# Altium schematic sheet FPGA.SchDoc
size 840 x 594 mm; SheetNumber: 2; SheetTotal: 4
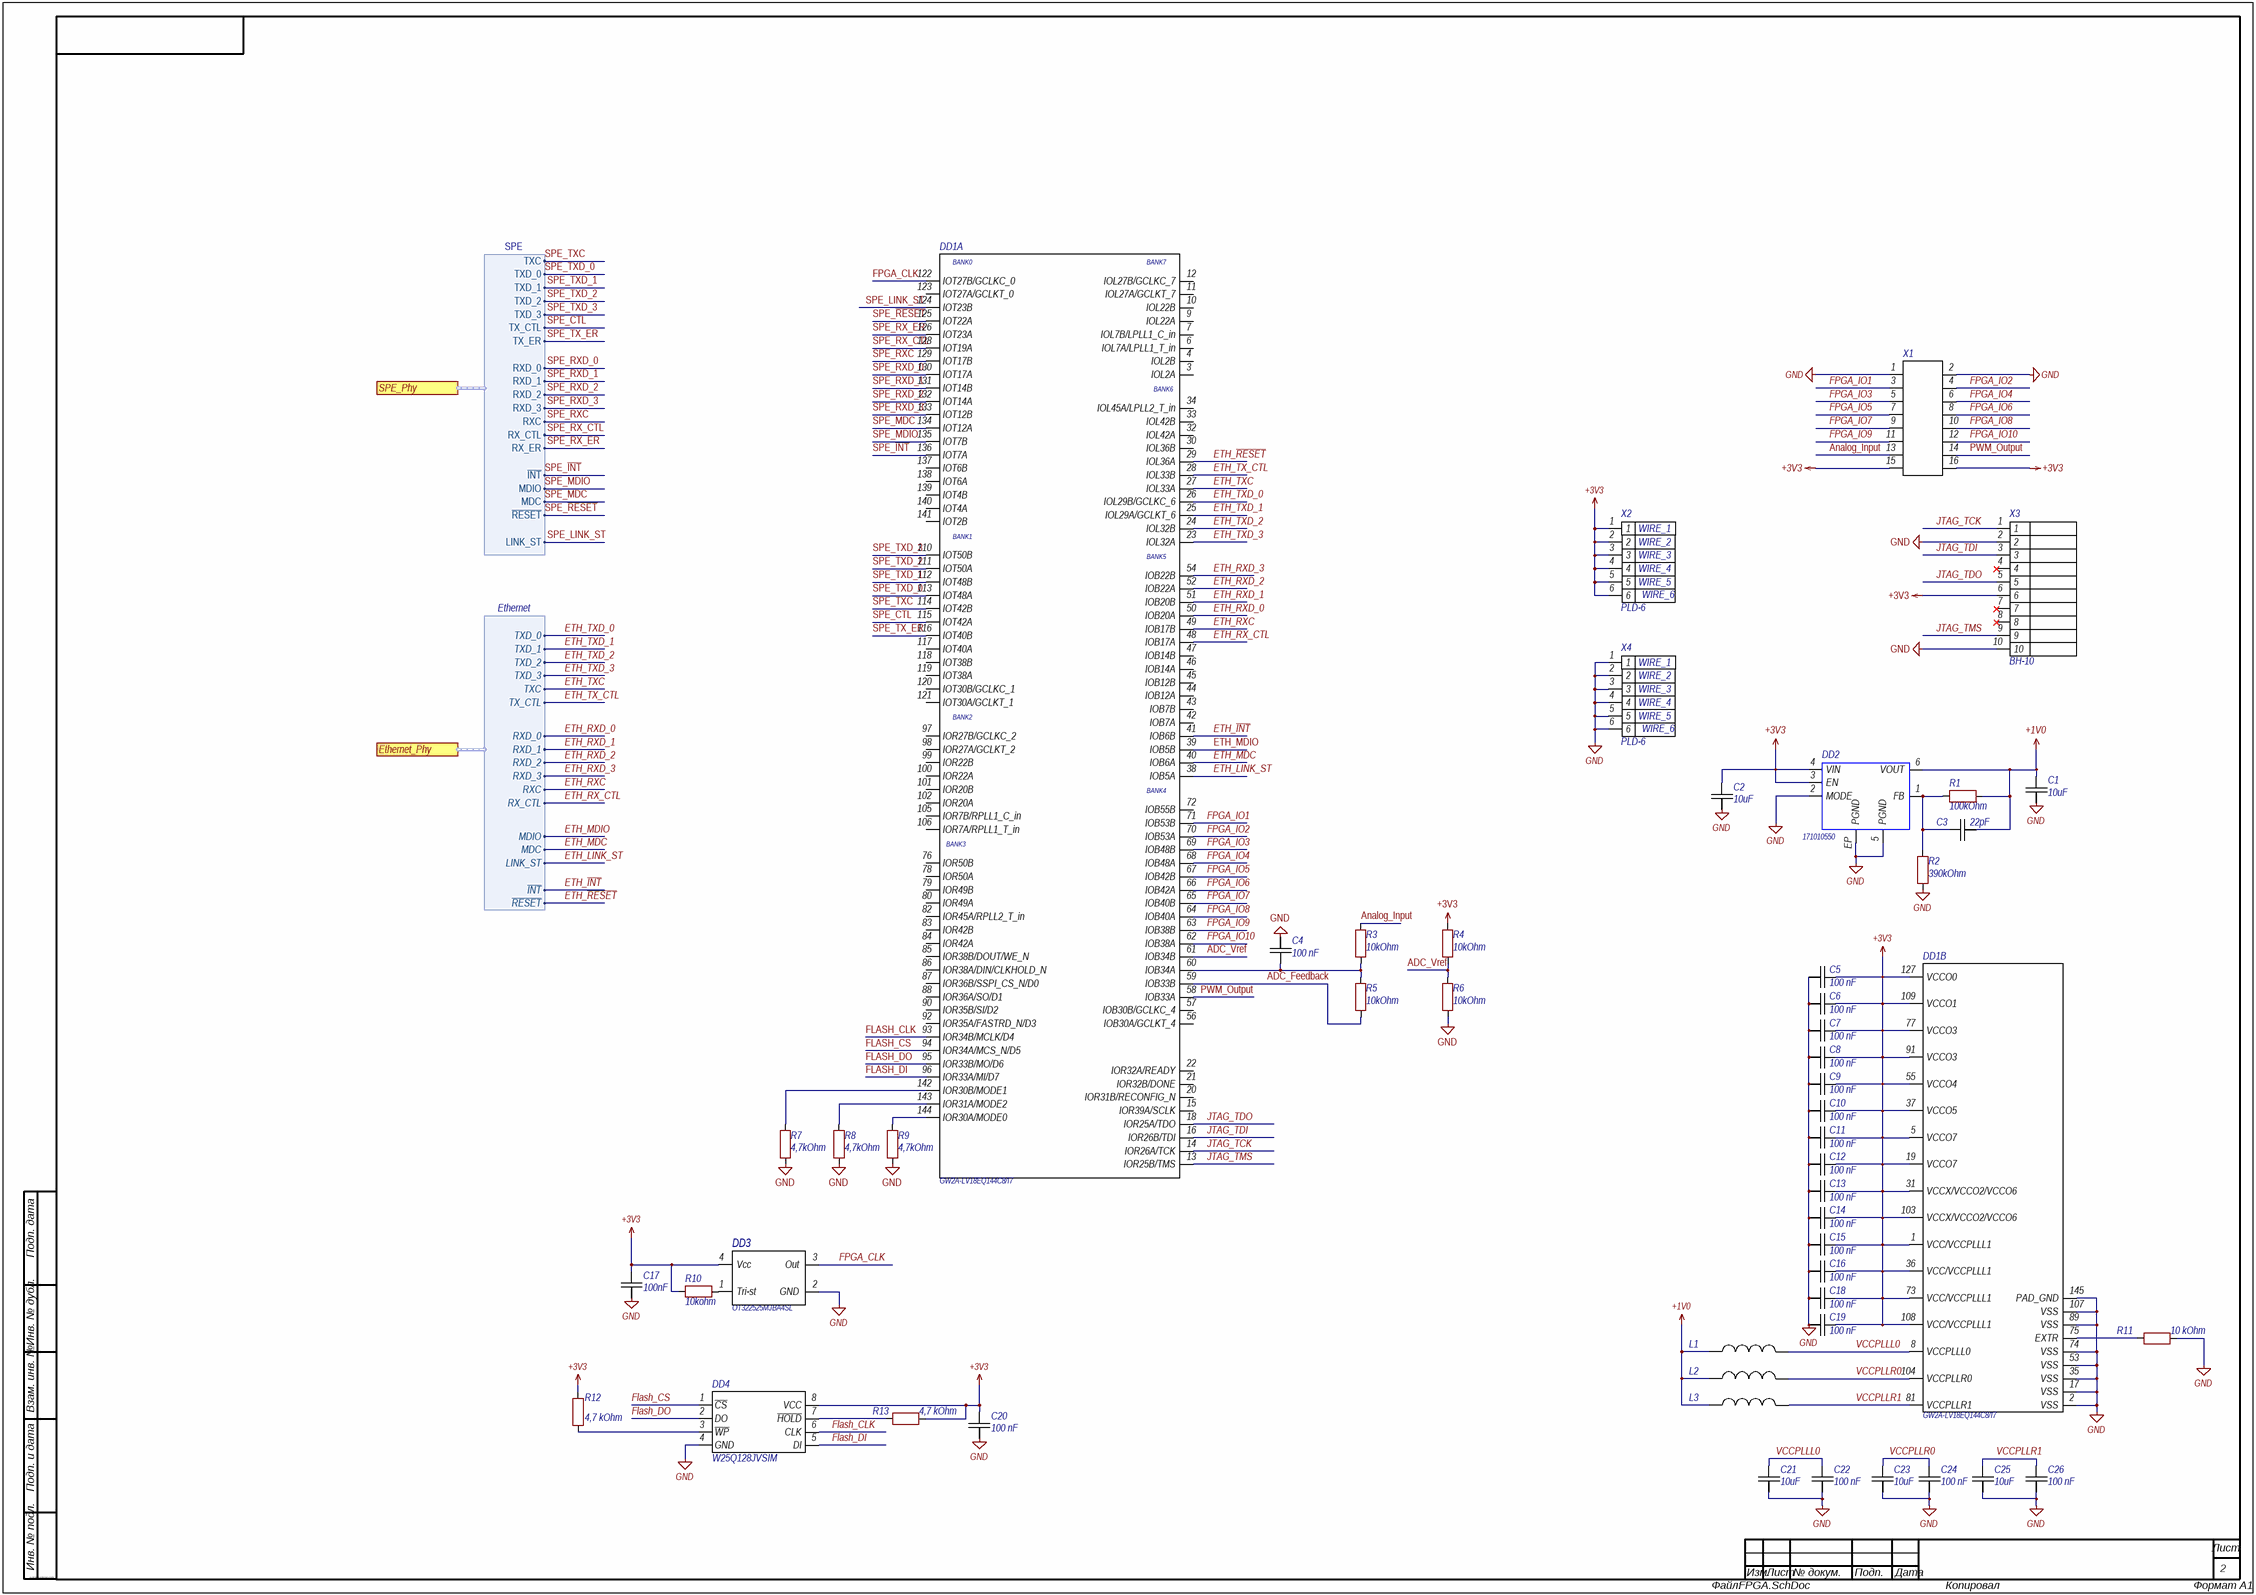
[diagram p0: FPGA.SchDoc]

## Parts
C1  value 10uF  [CAPC0603N]  (hidden comment: 10uF 25V)
C2  value 10uF  [CAPC0603N]  (hidden comment: 10uF 25V)
C3  value 22pF  [CAP0402]  (hidden comment: 22pF 50V)
C4  value 100 nF  [CAP0402]  (hidden comment: 100 nF *)
C5  value 100 nF  [CAP0402]  (hidden comment: 100 nF 50V)
C6  value 100 nF  [CAP0402]  (hidden comment: 100 nF 50V)
C7  value 100 nF  [CAP0402]  (hidden comment: 100 nF 50V)
C8  value 100 nF  [CAP0402]  (hidden comment: 100 nF 50V)
C9  value 100 nF  [CAP0402]  (hidden comment: 100 nF 50V)
C10  value 100 nF  [CAP0402]  (hidden comment: 100 nF 50V)
C11  value 100 nF  [CAP0402]  (hidden comment: 100 nF 50V)
C12  value 100 nF  [CAP0402]  (hidden comment: 100 nF 50V)
C13  value 100 nF  [CAP0402]  (hidden comment: 100 nF 50V)
C14  value 100 nF  [CAP0402]  (hidden comment: 100 nF 50V)
C15  value 100 nF  [CAP0402]  (hidden comment: 100 nF 50V)
C16  value 100 nF  [CAP0402]  (hidden comment: 100 nF 50V)
C17  value 100nF  [CAP0402]  (hidden comment: 100nF 50V)
C18  value 100 nF  [CAP0402]  (hidden comment: 100 nF 50V)
C19  value 100 nF  [CAP0402]  (hidden comment: 100 nF 50V)
C20  value 100 nF  [CAP0402]  (hidden comment: 100 nF 50V)
C21  value 10uF  [CAPC0603N]  (hidden comment: 10uF 25V)
C22  value 100 nF  [CAP0402]  (hidden comment: 100 nF 50V)
C23  value 10uF  [CAPC0603N]  (hidden comment: 10uF 25V)
C24  value 100 nF  [CAP0402]  (hidden comment: 100 nF 50V)
C25  value 10uF  [CAPC0603N]  (hidden comment: 10uF 25V)
C26  value 100 nF  [CAP0402]  (hidden comment: 100 nF 50V)
DD1  MPN: GW2A-LV18EQ144C8/I7  [EQ144]  (parts A,B of 2)
DD2  (no value)  [171010550]
DD3  MPN: OT322525MJBA4SL  [TSX-3225_V]  (hidden comment: 25MHz)
DD4  MPN: W25Q128JVSIM  [SO-8]
L1  (no value)  [CAPC0603N]
L2  (no value)  [CAPC0603N]
L3  (no value)  [CAPC0603N]
R1  100kOhm  [RESC0402(1005)_M]
R2  390kOhm  [RESC0402(1005)_M]
R3  10kOhm  [RESC0402(1005)_M]
R4  10kOhm  [RESC0402(1005)_M]
R5  10kOhm  [RESC0402(1005)_M]
R6  10kOhm  [RESC0402(1005)_M]
R7  4,7kOhm  [RESC0402(1005)_M]
R8  4,7kOhm  [RESC0402(1005)_M]
R9  4,7kOhm  [RESC0402(1005)_M]
R10  10kohm  [RESC0402(1005)_M]
R11  10 kOhm  [RESC0402(1005)_M]
R12  4,7 kOhm  [RESC0402(1005)_M]
R13  4,7 kOhm  [RESC0402(1005)_M]
X1  (no value)  [PBD16]
X2  Wire6: WIRE_6  Wire5: WIRE_5  Wire4: WIRE_4  Wire3: WIRE_3  Wire2: WIRE_2  Wire1: WIRE_1  [PLD_6]  (hidden comment: PLD-6)
X3  BH-10  [BH-10]
X4  Wire6: WIRE_6  Wire5: WIRE_5  Wire4: WIRE_4  Wire3: WIRE_3  Wire2: WIRE_2  Wire1: WIRE_1  [PLD_6]  (hidden comment: PLD-6)

## Ports
Ethernet_Phy (harness Ethernet), SPE_Phy (harness SPE)

## Harnesses
Ethernet: ~{INT}, LINK_ST, MDC, MDIO, ~{RESET}, RX_CTL, RXC, RXD_0, RXD_1, RXD_2, RXD_3, TX_CTL, TXC, TXD_0, TXD_1, TXD_2, TXD_3
SPE: TXC, TXD_0, TXD_1, TXD_2, TXD_3, TX_CTL, TX_ER, RXD_0, RXD_1, RXD_2, RXD_3, RXC, RX_CTL, RX_ER, ~{INT}, MDIO, MDC, ~{RESET}, LINK_ST

## Nets
+1V0: C1.2 C3.1 DD2.6(VOUT) L1.1 L2.1 L3.1 R1.1
+3V3: C2.2 C5.2 C6.2 C7.2 C8.2 C9.2 C10.2 C11.2 C12.2 C13.2 C14.2 C15.2 C16.2 C17.2 C18.2 C19.2 C20.2 DD1.1(VCC/VCCPLLL1) DD1.5(VCCO7) DD1.19(VCCO7) DD1.31(VCCX/VCCO2/VCCO6) DD1.36(VCC/VCCPLLL1) DD1.37(VCCO5) DD1.55(VCCO4) DD1.73(VCC/VCCPLLL1) DD1.77(VCCO3) DD1.91(VCCO3) DD1.103(VCCX/VCCO2/VCCO6) DD1.108(VCC/VCCPLLL1) DD1.109(VCCO1) DD1.127(VCCO0) DD2.3(EN) DD2.4(VIN) DD3.4(Vcc) DD4.8(VCC) R4.2 R10.1 R12.1 R13.2 X1.15 X1.16 X2.1 X2.2 X2.3 X2.4 X2.5 X2.6 X3.6
GND: C1.1 C2.1 C4.1 C5.1 C6.1 C7.1 C8.1 C9.1 C10.1 C11.1 C12.1 C13.1 C14.1 C15.1 C16.1 C17.1 C18.1 C19.1 C20.1 C21.1 C22.1 C23.1 C24.1 C25.1 C26.1 DD1.2(VSS) DD1.17(VSS) DD1.35(VSS) DD1.53(VSS) DD1.74(VSS) DD1.89(VSS) DD1.107(VSS) DD1.145(PAD_GND) DD2.2(MODE) DD2.5(PGND) DD2.EP(PGND) DD3.2(GND) DD4.4(GND) R2.1 R6.1 R7.1 R8.1 R9.1 R11.2 X1.1 X1.2 X3.2 X3.10 X4.1 X4.2 X4.3 X4.4 X4.5 X4.6
ADC_Feedback: DD1.59(IOB33B) R5.1
ADC_Vref: DD1.61(IOB34B) R4.1 R6.2
Analog_Input: R3.2 X1.13
ETH_~{INT}: DD1.41(IOB6B) ; port Ethernet_Phy.~{INT}
ETH_LINK_ST: DD1.38(IOB5A) ; port Ethernet_Phy.LINK_ST
ETH_MDC: DD1.40(IOB6A) ; port Ethernet_Phy.MDC
ETH_MDIO: DD1.39(IOB5B) ; port Ethernet_Phy.MDIO
ETH_~{RESET}: DD1.29(IOL36A) ; port Ethernet_Phy.~{RESET}
ETH_RX_CTL: DD1.48(IOB17A) ; port Ethernet_Phy.RX_CTL
ETH_RXC: DD1.49(IOB17B) ; port Ethernet_Phy.RXC
ETH_RXD_0: DD1.50(IOB20A) ; port Ethernet_Phy.RXD_0
ETH_RXD_1: DD1.51(IOB20B) ; port Ethernet_Phy.RXD_1
ETH_RXD_2: DD1.52(IOB22A) ; port Ethernet_Phy.RXD_2
ETH_RXD_3: DD1.54(IOB22B) ; port Ethernet_Phy.RXD_3
ETH_TX_CTL: DD1.28(IOL33B) ; port Ethernet_Phy.TX_CTL
ETH_TXC: DD1.27(IOL33A) ; port Ethernet_Phy.TXC
ETH_TXD_0: DD1.26(IOL29B/GCLKC_6) ; port Ethernet_Phy.TXD_0
ETH_TXD_1: DD1.25(IOL29A/GCLKT_6) ; port Ethernet_Phy.TXD_1
ETH_TXD_2: DD1.24(IOL32B) ; port Ethernet_Phy.TXD_2
ETH_TXD_3: DD1.23(IOL32A) ; port Ethernet_Phy.TXD_3
Flash_CLK: DD1.93(IOR34B/MCLK/D4) DD4.6(CLK)
Flash_CS: DD1.94(IOR34A/MCS_N/D5) DD4.1(~{CS})
Flash_DI: DD1.96(IOR33A/MI/D7) DD4.5(DI)
Flash_DO: DD1.95(IOR33B/MO/D6) DD4.2(DO)
FPGA_CLK: DD1.122(IOT27B/GCLKC_0) DD3.3(Out)
FPGA_IO1: DD1.71(IOB53B) X1.3
FPGA_IO2: DD1.70(IOB53A) X1.4
FPGA_IO3: DD1.69(IOB48B) X1.5
FPGA_IO4: DD1.68(IOB48A) X1.6
FPGA_IO5: DD1.67(IOB42B) X1.7
FPGA_IO6: DD1.66(IOB42A) X1.8
FPGA_IO7: DD1.65(IOB40B) X1.9
FPGA_IO8: DD1.64(IOB40A) X1.10
FPGA_IO9: DD1.63(IOB38B) X1.11
FPGA_IO10: DD1.62(IOB38A) X1.12
JTAG_TCK: DD1.14(IOR26A/TCK) X3.1
JTAG_TDI: DD1.16(IOR26B/TDI) X3.3
JTAG_TDO: DD1.18(IOR25A/TDO) X3.5
JTAG_TMS: DD1.13(IOR25B/TMS) X3.9
PWM_Output: DD1.58(IOB33A) X1.14
SPE_CTL: DD1.115(IOT42A) ; port SPE_Phy.TX_CTL
SPE_~{INT}: DD1.136(IOT7A) ; port SPE_Phy.~{INT}
SPE_LINK_ST: DD1.124(IOT23B) ; port SPE_Phy.LINK_ST
SPE_MDC: DD1.134(IOT12A) ; port SPE_Phy.MDC
SPE_MDIO: DD1.135(IOT7B) ; port SPE_Phy.MDIO
SPE_~{RESET}: DD1.125(IOT22A) ; port SPE_Phy.~{RESET}
SPE_RX_CTL: DD1.128(IOT19A) ; port SPE_Phy.RX_CTL
SPE_RX_ER: DD1.126(IOT23A) ; port SPE_Phy.RX_ER
SPE_RXC: DD1.129(IOT17B) ; port SPE_Phy.RXC
SPE_RXD_0: DD1.130(IOT17A) ; port SPE_Phy.RXD_0
SPE_RXD_1: DD1.131(IOT14B) ; port SPE_Phy.RXD_1
SPE_RXD_2: DD1.132(IOT14A) ; port SPE_Phy.RXD_2
SPE_RXD_3: DD1.133(IOT12B) ; port SPE_Phy.RXD_3
SPE_TX_ER: DD1.116(IOT40B) ; port SPE_Phy.TX_ER
SPE_TXC: DD1.114(IOT42B) ; port SPE_Phy.TXC
SPE_TXD_0: DD1.113(IOT48A) ; port SPE_Phy.TXD_0
SPE_TXD_1: DD1.112(IOT48B) ; port SPE_Phy.TXD_1
SPE_TXD_2: DD1.111(IOT50A) ; port SPE_Phy.TXD_2
SPE_TXD_3: DD1.110(IOT50B) ; port SPE_Phy.TXD_3
VCCPLLL0: C21.2 C22.2 DD1.8(VCCPLLL0) L1.2
VCCPLLR0: C23.2 C24.2 DD1.104(VCCPLLR0) L2.2
VCCPLLR1: C25.2 C26.2 DD1.81(VCCPLLR1) L3.2
NetC3_2: C3.2 DD2.1(FB) R1.2 R2.2
NetC4_2: C4.2 DD1.60(IOB34A) R3.1 R5.2
NetDD1_75: DD1.75(EXTR) R11.1
NetDD1_142: DD1.142(IOR30B/MODE1) R7.2
NetDD1_143: DD1.143(IOR31A/MODE2) R8.2
NetDD1_144: DD1.144(IOR30A/MODE0) R9.2
NetDD3_1: DD3.1(Tri-st) R10.2
NetDD4_3: DD4.3(~{WP}) R12.2
NetDD4_7: DD4.7(~{HOLD}) R13.1

Not connected (* = marked no-connect by the designer): DD1 3(IOL2A) 4(IOL2B) 6(IOL7A/LPLL1_T_in) 7(IOL7B/LPLL1_C_in) 9(IOL22A) 10(IOL22B) 11(IOL27A/GCLKT_7) 12(IOL27B/GCLKC_7) 15(IOR39A/SCLK) 20(IOR31B/RECONFIG_N) 21(IOR32B/DONE) 22(IOR32A/READY) 30(IOL36B) 32(IOL42A) 33(IOL42B) 34(IOL45A/LPLL2_T_in) 42(IOB7A) 43(IOB7B) 44(IOB12A) 45(IOB12B) 46(IOB14A) 47(IOB14B) 56(IOB30A/GCLKT_4) 57(IOB30B/GCLKC_4) 72(IOB55B) 76(IOR50B) 78(IOR50A) 79(IOR49B) 80(IOR49A) 82(IOR45A/RPLL2_T_in) 83(IOR42B) 84(IOR42A) 85(IOR38B/DOUT/WE_N) 86(IOR38A/DIN/CLKHOLD_N) 87(IOR36B/SSPI_CS_N/D0) 88(IOR36A/SO/D1) 90(IOR35B/SI/D2) 92(IOR35A/FASTRD_N/D3) 97(IOR27B/GCLKC_2) 98(IOR27A/GCLKT_2) 99(IOR22B) 100(IOR22A) 101(IOR20B) 102(IOR20A) 105(IOR7B/RPLL1_C_in) 106(IOR7A/RPLL1_T_in) 117(IOT40A) 118(IOT38B) 119(IOT38A) 120(IOT30B/GCLKC_1) 121(IOT30A/GCLKT_1) 123(IOT27A/GCLKT_0) 137(IOT6B) 138(IOT6A) 139(IOT4B) 140(IOT4A) 141(IOT2B); X3 4* 7* 8*

## Notes on the sheet
- Подп. дата
- Инв. № дубл.
- Взам. инв. №
- Подп. и дата
- Инв. № подл.
- Изм.
- Лист
- № докум.
- Подп.
- Дата
- ALTIUM GOSTBOM2.0 KEV
- Файл:
- Копировал
- Формат А1
- (in symbol GW2A-LV18EQ144C8/I7, part A) BANK0; BANK7; BANK6; BANK1; BANK5; BANK2; BANK4; BANK3

## Library data of the parts
C1 C2 C21 C23 C25 = CAPC: MntType: SMD; MSL: MSL 1; Package: =Footprint; RoHS: Comply; PartType: CHIP CERAMIC CAPACITOR; Pins: 2; BOMDescription: =MntType+' '+PartType+' '+Package+' '+Value+' '+Tolerance+' '+Voltage+' '+TempCoeff+' '+MPN; CFootprint: =Footprint; Voltage: 25V; Part Number: CAPC; ClassName: Capacitor; ComponentLink1Description: Datasheet
C3 C5-C20 C22 C24 C26 = CAP0402: MntType: SMD; MSL: MSL 1; Package: =Footprint; RoHS: Comply; PartType: CHIP CERAMIC CAPACITOR; Pins: 2; BOMDescription: =MntType+' '+PartType+' '+Package+' '+Value+' '+Tolerance+' '+Voltage+' '+TempCoeff+' '+MPN; CFootprint: =Footprint; Voltage: 50V; Part Number: CAP0402; ClassName: Capacitor; ComponentLink1Description: Datasheet
C4 = CAP0402: PartTypeRUS: пїЅпїЅпїЅпїЅпїЅпїЅпїЅпїЅпїЅпїЅпїЅ; MntType: SMD; ID: 82; MSL: MSL 1; Package: =Footprint; RoHS: Comply; PartType: CHIP CERAMIC CAPACITOR; Pins: 2; BOMDescription: =MntType+' '+PartType+' '+Package+' '+Value+' '+Tolerance+' '+Voltage+' '+TempCoeff+' '+MPN; CFootprint: =Footprint; Voltage: *; Part Number: CAP0402; BOMDescriptionRUS: пїЅпїЅпїЅпїЅпїЅпїЅпїЅпїЅпїЅпїЅпїЅ; ClassName: Capacitor; ComponentLink1Description: Datasheet
DD1 = GW2A-LV18EQ144C8/I7: Manufacturer: GoWin; PartTypeRUS: пїЅпїЅпїЅпїЅпїЅпїЅпїЅпїЅпїЅпїЅ; ID: 149; MntType: SMD; BOMDescriptionRUS: пїЅпїЅпїЅпїЅпїЅпїЅпїЅпїЅпїЅпїЅ GW2A-LV18EQ144C8/I7; Part Number: GW2A-LV18EQ144C8/I7; MSL: MSL 1; Package: EQ144; RoHS: Comply; PartType: FPGA; BOMDescription: GW2A-LV18EQ144C8/I7; Pins: 144; CFootprint: =Footprint; ClassName: FPGA; ComponentLink1Description: Datasheet; ComponentLink1URL: https://gowinsemi.com/en/support/database/?support_search=DS102
DD2 = 171010550: Manufacturer: WE; MntType: SMD; MPN: 171010550; Part Number: 171010550; MSL: MSL 1; Package: LGA-6EP; RoHS: Comply; PartType: Buck converter; Pins: 8; BOMDescription: 171010550; CFootprint: =Footprint; ClassName: Buck; ComponentLink1Description: Datasheet; ComponentLink1URL: https://www.we-online.com/catalog/datasheet/171010550_valid_from_2021-12-01.pdf
DD3 = OT322525MJBA4SL: Manufacturer: Yangxing Tech; MntType: SMD; Part Number: OT322525MJBA4SL; Value: 25MHz; MSL: MSL 1; Package: SMD3225; RoHS: Comply; PartType: Oscillator; Pins: 4; BOMDescription: OT322525MJBA4SL; CFootprint: =Footprint; ClassName: Oscillator; ComponentLink1Description: Datasheet; ComponentLink1URL: https://datasheet.lcsc.com/lcsc/2103291238_Yangxing-Tech-OT322525MJBA4SL_C669088.pdf
DD4 = W25Q128JVSIM: Manufacturer: WINBOND; MntType: SMD; Part Number: W25Q128JVSIM; MSL: MSL 1; Package: SO-8; RoHS: Comply; PartType: Flash; Pins: 8; BOMDescription: W25Q128JVSIM; CFootprint: =Footprint; ClassName: Flash; ComponentLink1Description: Datasheet; ComponentLink1URL: https://www.winbond.com/resource-files/w25q128jv_dtr%20revc%2003272018%20plus.pdf
L1-L3 = BLM18KG221SN1D: Manufacturer: Murata; MntType: SMD; MPN: BLM18KG221SN1D; MSL: MSL 1; Package: =Footprint; RoHS: Comply; PartType: Ferrite Beads; Pins: 2; BOMDescription: =MntType+' '+PartType+' '+Package+' '+Value+' '+Tolerance+' '+Voltage+' '+TempCoeff+' '+MPN; CFootprint: =Footprint; Part Number: BLM18KG221SN1D; ClassName: Ferrite Beads; ComponentLink1Description: Datasheet; ComponentLink1URL: https://ru.mouser.com/datasheet/2/281/ENFA0003-1915778.pdf
R1 R2 R10-R13 = RES0402: MntType: SMD; MSL: MSL 1; Package: =Footprint; RoHS: Comply; PartType: CHIP RESISTOR; Pins: 2; BOMDescription: =MntType+' '+PartType+' '+Package+' '+Value+' '+Tolerance+' '+Voltage+' '+TempCoeff+' '+MPN; CFootprint: =Footprint; Part Number: RES0402; ClassName: Resistor; ComponentLink1Description: Datasheet
  R1: Value: 100kOhm
  R2: Value: 390kOhm
  R10: Value: 10kohm
  R11: Value: 10 kOhm
  R12 R13: Value: 4,7 kOhm
R3-R9 = RES0402: PartTypeRUS: пїЅпїЅпїЅпїЅпїЅпїЅпїЅпїЅ; MntType: SMD; ID: 301; MSL: MSL 1; Package: =Footprint; RoHS: Comply; PartType: CHIP RESISTOR; Pins: 2; BOMDescription: =MntType+' '+PartType+' '+Package+' '+Value+' '+Tolerance+' '+Voltage+' '+TempCoeff+' '+MPN; CFootprint: =Footprint; Part Number: RES0402; BOMDescriptionRUS: пїЅпїЅпїЅпїЅпїЅпїЅпїЅпїЅ; ClassName: Resistor; ComponentLink1Description: Datasheet
  R3-R6: Value: 10kOhm
  R7-R9: Value: 4,7kOhm
X1 = Connector_16pin: PartTypeRUS: пїЅпїЅпїЅпїЅпїЅпїЅ; ID: 101; MntType: DIP; Part Number: Connector_16pin; MSL: MSL 1; RoHS: Comply; PartType: CONNECTOR; BOMDescription: =MntType+' '+PartType+' '+Package+' '+Value+' '+Tolerance+' '+Voltage+' '+TempCoeff+' '+MPN; Pins: 16; BOMDescriptionRUS: =PartTypeRUS+' '+MPN; CFootprint: =Footprint; ClassName: Connector; System: Connector; ComponentLink1Description: Datasheet
X2 X4 = PLD-6: Wire8: WIRE_8; Wire7: WIRE_7; MntType: DIP; System: Connector; MPN: PLD-6; Part Number: PLD-6; MSL: MSL 1; RoHS: Comply; PartType: CONNECTOR; Pins: 6; BOMDescription: PLD-6; CFootprint: =Footprint; ClassName: Connector; ComponentLink1Description: Datasheet
X3 = BH-10: PartTypeRUS: пїЅпїЅпїЅпїЅпїЅпїЅ; ID: 68; MntType: DIP; BOMDescriptionRUS: пїЅпїЅпїЅпїЅпїЅпїЅ BH-10; System: Connector; MPN: BH-10; Part Number: BH-10; MSL: MSL 1; Package: BH-10; RoHS: Comply; PartType: CONNECTOR; BOMDescription: =MntType+' '+PartType+' '+Package+' '+Value+' '+Tolerance+' '+Voltage+' '+TempCoeff+' '+MPN; Pins: 10; CFootprint: =Footprint; ClassName: Connector; ComponentLink1Description: Datasheet